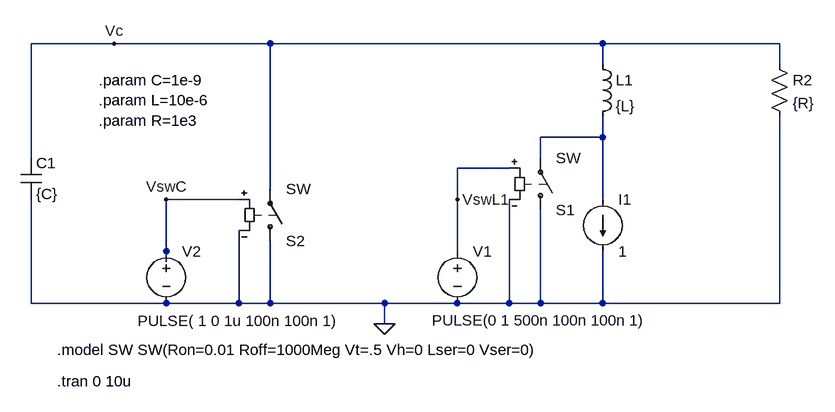
[diagram p0: schematic LCOscillatorILInitial.asc]
LCOscillatorILInitial.asc, the LTspice schematic file:
Version 4
SHEET 1 1652 680
WIRE -96 96 -224 96
WIRE 144 96 -96 96
WIRE 656 96 144 96
WIRE 928 96 656 96
WIRE 656 128 656 96
WIRE 928 128 928 96
WIRE 656 240 656 208
WIRE 656 240 560 240
WIRE -224 272 -224 96
WIRE 560 272 560 240
WIRE 512 288 432 288
WIRE 144 320 144 96
WIRE 96 336 -16 336
WIRE 432 336 432 288
WIRE 656 336 656 240
WIRE -16 416 -16 336
WIRE 432 416 432 336
WIRE -16 432 -16 416
WIRE -224 496 -224 336
WIRE -16 496 -224 496
WIRE 96 496 96 384
WIRE 96 496 -16 496
WIRE 144 496 144 400
WIRE 144 496 96 496
WIRE 320 496 144 496
WIRE 432 496 320 496
WIRE 512 496 512 336
WIRE 512 496 432 496
WIRE 560 496 560 352
WIRE 560 496 512 496
WIRE 656 496 656 416
WIRE 656 496 560 496
WIRE 928 496 928 208
WIRE 928 496 656 496
WIRE 320 528 320 496
FLAG 320 528 0
FLAG -96 96 Vc
FLAG -16 336 VswC
FLAG 432 336 VswL1
SYMBOL cap -240 272 R0
SYMATTR InstName C1
SYMATTR Value {C}
SYMBOL ind 640 112 R0
SYMATTR InstName L1
SYMATTR Value {L}
SYMBOL res 912 112 R0
SYMATTR InstName R2
SYMATTR Value {R}
SYMBOL sw 144 416 M180
SYMATTR InstName S2
SYMBOL sw 560 368 M180
SYMATTR InstName S1
SYMBOL voltage -16 400 R0
WINDOW 3 -44 123 Left 2
WINDOW 123 0 0 Left 2
WINDOW 39 0 0 Left 2
SYMATTR Value PULSE( 1 0 1u 100n 100n 1)
SYMATTR InstName V2
SYMBOL voltage 432 400 R0
WINDOW 3 -39 122 Left 2
WINDOW 123 0 0 Left 2
WINDOW 39 0 0 Left 2
SYMATTR Value PULSE(0 1 500n 100n 100n 1)
SYMATTR InstName V1
SYMBOL current 656 336 R0
WINDOW 123 0 0 Left 2
WINDOW 39 0 0 Left 2
SYMATTR InstName I1
SYMATTR Value 1
TEXT -184 568 Left 2 !.model SW SW(Ron=0.01 Roff=1000Meg Vt=.5 Vh=0 Lser=0 Vser=0)
TEXT -184 616 Left 2 !.tran 0 10u
TEXT -120 152 Left 2 !.param C=1e-9 \n.param L=10e-6\n.param R=1e3

The netlist it stands for:
* LCOscillatorILInitial.asc
C1 Vc 0 {C}
L1 Vc N001 {L}
R2 Vc 0 {R}
S2 0 Vc VswC 0 SW
S1 0 N001 VswL1 0 SW
V2 VswC 0 PULSE( 1 0 1u 100n 100n 1)
V1 VswL1 0 PULSE(0 1 500n 100n 100n 1)
I1 N001 0 1
.model SW SW(Ron=0.01 Roff=1000Meg Vt=.5 Vh=0 Lser=0 Vser=0)
.tran 0 10u
.param C=1e-9
.param L=10e-6
.param R=1e3
.backanno
.end